# Altium schematic sheet PicoModuleInterface.SchDoc
size 297 x 209 mm; SheetNumber: 1; SheetTotal: 2; swcgroup: FabLab; Org: Sainsbury Wellcome Centre; Add1: 25 Howland Street; Add2: London; Add3: W1T 4JG; WebAddress: www.sainsburywellcome.org; SheetSize: A4; SheetName: Pico Module Interface
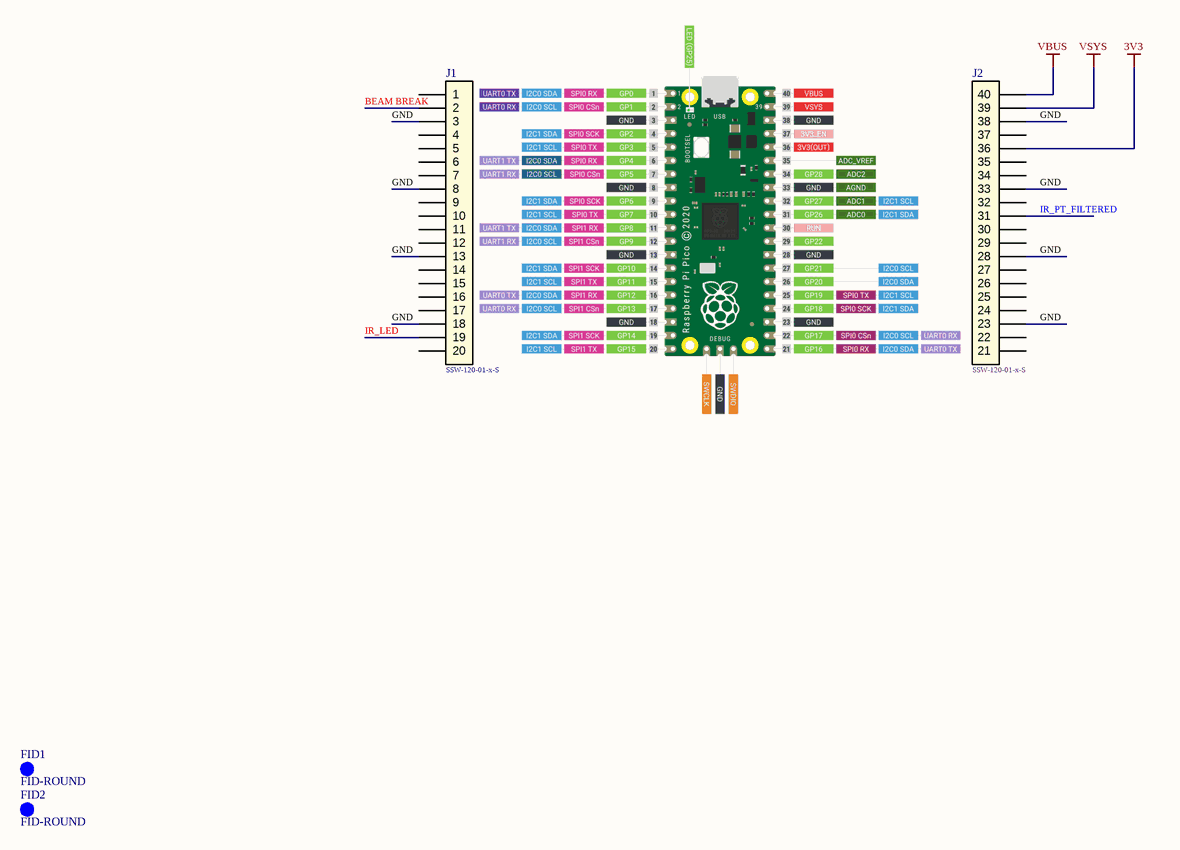
[diagram p0: PicoModuleInterface.SchDoc]

## Parts
FID1  FID-ROUND  [Fid_Round]  (no BOM)
FID2  FID-ROUND  [Fid_Round]  (no BOM)
J1  SSW-120-01-x-S  [SAMTEC_SSW-120-01-G-S]
J2  SSW-120-01-x-S - 21-40  [SAMTEC_SSW-120-01-G-S - 21-40]  (value not drawn)

## Nets
3V3: J2.36
VBUS: J2.40
VSYS: J2.39
BEAM BREAK: J1.2
GND: J1.3 J1.8 J1.13 J1.18 J2.23 J2.28 J2.33 J2.38
IR_LED: J1.19
IR_PT_FILTERED: J2.31

Not connected (* = marked no-connect by the designer): J1 1 4 5 6 7 9 10 11 12 14 15 16 17 20; J2 21 22 24 25 26 27 29 30 32 34 35 37

## Notes on the sheet
- (near J2) SSW-120-01-x-S
- FILE
- VARIANT
- DATE
- REVISION
- SHEET
- /
- PROJECT
- SIZE

## Library data of the parts
FID1 FID2 = CMP-C00-0001-2: Round Fiducial
J1 = CMP-310-0034-3: Conn Socket Strip SKT 20 POS 2.54mm Solder ST Thru-Hole; Gender: Female; Number of Contacts: 20; Mating Cycles: 100; Number of Rows: 1; Color: Black; RoHS Compliant: Yes; Contact Plating: Gold; Pitch: 2.54mm; Termination: Solder; Contact Material: Bronze; Mount: Through Hole
J2 = CMP-310-0035-2: Conn Socket Strip SKT 20 POS 2.54mm Solder ST Thru-Hole (pins 21 - 40); Gender: Female; Mating Cycles: 100; Number of Contacts: 20; Contact Material: Bronze; RoHS Compliant: Yes; Number of Rows: 1; Contact Plating: Gold; Mount: Through Hole; Pitch: 2.54mm; Termination: Solder; Color: Black